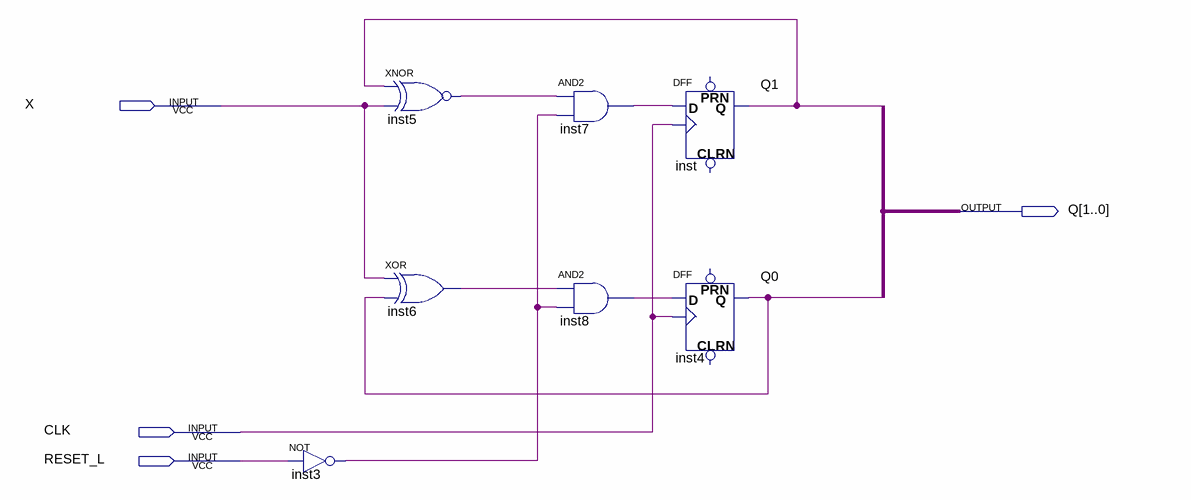
[diagram p0: schematic sheet]
// Quartus schematic MEF.bdf as structural Verilog: 7 symbols, 4 pins
module MEF (
  input  X,
  input  CLK,
  input  RESET_L,
  output [1:0] Q
);

  wire inst3_out, inst5_out, inst6_out, inst7_out, inst8_out;

  not inst3 (inst3_out, RESET_L);
  xnor inst5 (inst5_out, Q[1], X);
  xor inst6 (inst6_out, X, Q[0]);
  and inst7 (inst7_out, inst5_out, inst3_out);
  and inst8 (inst8_out, inst6_out, inst3_out);
  DFF inst (.CLK(CLK), .D(inst7_out), .Q(Q[1]));  // open: CLRN, PRN
  DFF inst4 (.CLK(CLK), .D(inst8_out), .Q(Q[0]));  // open: CLRN, PRN
endmodule
